# EAGLE design BH67172NUX-FPC (EAGLE 7.1.0)
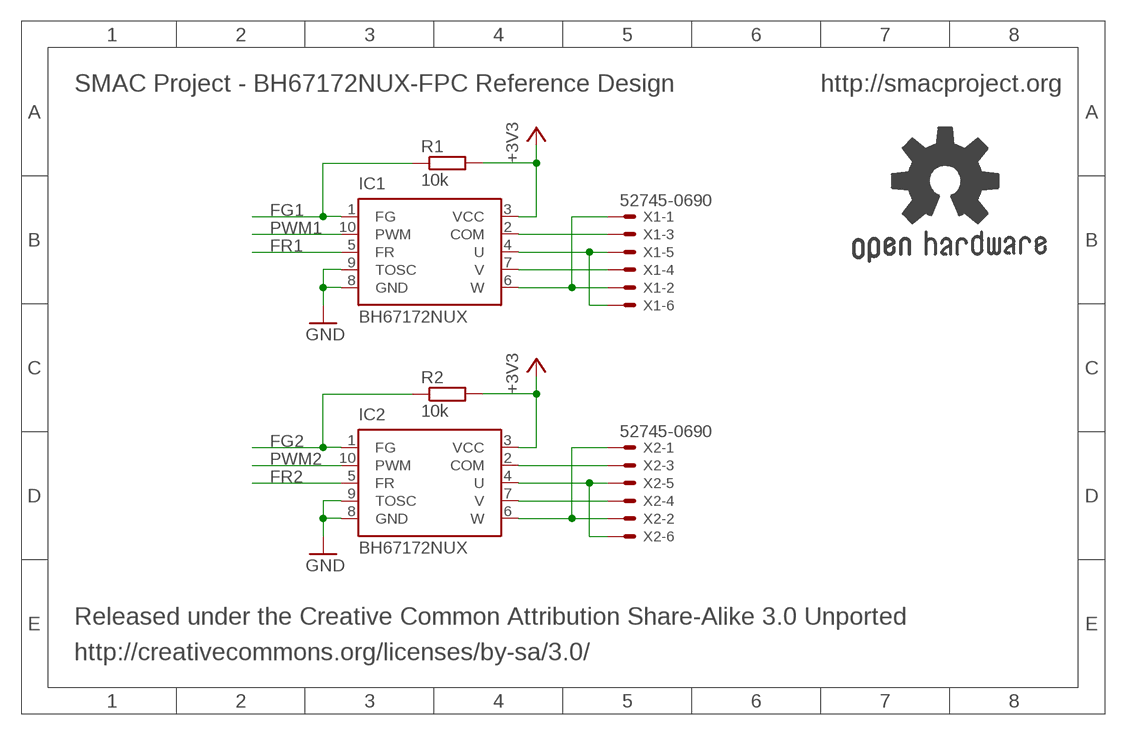
[diagram p0: schematic, sheet 1]

## Parts
GOLD_ORB_SM1  OSHWLOGO_REF_SM  [OSHW2REF]
IC1  BH67172NUX  [VSON010X3030]
IC2  BH67172NUX  [VSON010X3030]
R1  10k  R-EU_R0402  [R0402]
R2  10k  R-EU_R0402  [R0402]
X1  52745-0690  [52745-0690]
X2  52745-0690  [52745-0690]

## Nets
+3V3: IC1.3(VCC) IC2.3(VCC) R1.2 R2.2
COM1: IC1.2(COM) X1.3
COM2: IC2.2(COM) X2.3
FG1: IC1.1(FG) R1.1
FG2: IC2.1(FG) R2.1
FR1: IC1.5(FR)
FR2: IC2.5(FR)
GND: IC1.8(GND) IC1.9(TOSC) IC2.8(GND) IC2.9(TOSC)
PWM1: IC1.10(PWM)
PWM2: IC2.10(PWM)
U1: IC1.4(U) X1.5 X1.6
U2: IC2.4(U) X2.5 X2.6
V1: IC1.7(V) X1.4
V2: IC2.7(V) X2.4
W1: IC1.6(W) X1.1 X1.2
W2: IC2.6(W) X2.1 X2.2

## Notes on the sheet
- SMAC Project - BH67172NUX-FPC Reference Design | http://smacproject.org
- Released under the Creative Common Attribution Share-Alike 3.0 Unported
- http://creativecommons.org/licenses/by-sa/3.0/

## Library data of the parts
GOLD_ORB_SM1 = bfl:OSHWLOGO: These are Open-Source Hardware logos.
IC1 IC2 = rohm:BH67172NUX
R1 R2 = resistor:R-EU_: RESISTOR, European symbol
X1 X2 = con-molex:52745-0690: FFC/FPC-to-Board 0.50mm (.020") SMT Top Contact Right Angle, ZIF, Style Receptacle 52745 / 52435 Source: http://www.molex.com/product/ffc/52745.html; MPN: 52745-0690; OC_FARNELL: unknown; OC_NEWARK: 92M6374

## Board
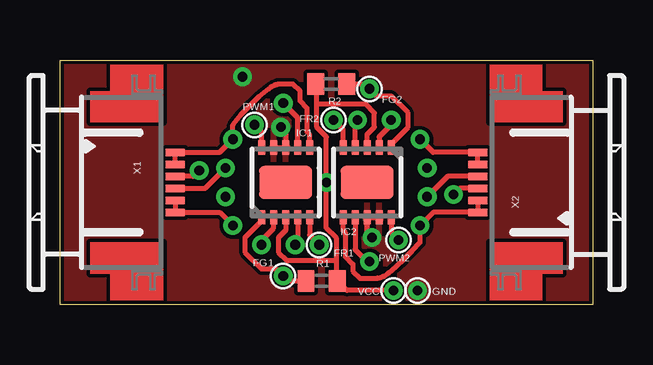
[diagram p1: board, top side]
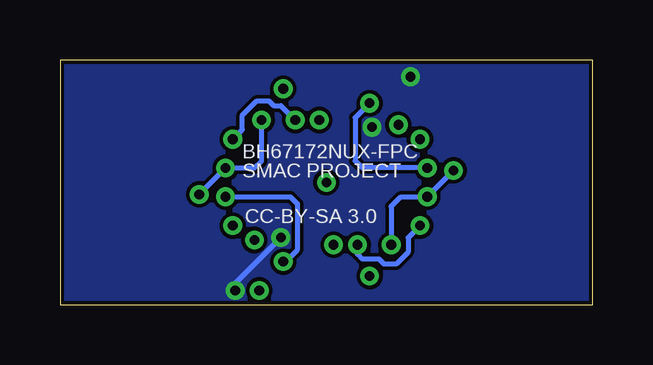
[diagram p2: board, bottom side, seen from below]

Size 22.2 x 10.2 mm. Coordinates in mm from the lower left corner, seen from the top.
Outline: 0,10.2 22.2,10.2 22.2,0 0,0 0,10.2
Copper layers (1*16): Top 0.035mm / dielectric 1.5mm / Bottom 0.035mm
Design rules "2_layer_standard_4pcb": minimum track width 5mil, minimum drill 15mil, track to track 6mil, track to pad 6mil, pad to pad 6mil, via to via 6mil, smd to smd 0mil, copper to edge 6mil, drill to drill 6mil, minimum pad ring 7.5mil, minimum via ring 7.5mil, stop-mask expansion 4mil, vias tented up to drill 15mil, thermal gap 20mil

### Footprints (pad centres in the part's own frame; a part is rotated, then mirrored left to right if it is on the bottom)
VSON010X3030 = smd 0.6 x 0.3: 1 -1.45,1; 2 -1.45,0.5; 3 -1.45,0; 4 -1.45,-0.5; 5 -1.45,-1; 6 1.45,-1; 7 1.45,-0.5; 8 1.45,0; 9 1.45,0.5; 10 1.45,1 | smd 1.36 x 2.2: G 0,0
R0402 = smd 0.7 x 0.9: 1 -0.65,0; 2 0.65,0
52745-0690 = smd 0.3 x 0.8: 1 -1.25,2.5; 2 -0.75,2.5; 3 -0.25,2.5; 4 0.25,2.5; 5 0.75,2.5; 6 1.25,2.5

### Placement (x,y rotation side)
GOLD_ORB_SM1  25.9,1.8 0 top  (outside the outline)
IC1  9.4,5.1 90 top
IC2  12.8,5.1 270 top
R1  10.9,1 0 top
R2  11.3,9.2 180 top
X1  2.3,5.1 270 top
X2  19.9,5.1 90 top

### Tracks (layer width: path | path; a pad name or v marks a point on that pad's centre or on a via)
+3V3  (via drill 0.4 pad 0.25)
  Top 0.203: IC1.3 9.4,3.1 9.1,2.8 9.1,2.2 9.45,1.85 11.5,1.85 | 10.7,8.35 12.75,8.35 13.1,8 13.1,7.4 12.8,7.1 IC2.3 | 11.5,1.85 11.5,2.8 11.1,3.2 v11.1,5.1 11.1,7 10.7,7.4 10.7,8.35 | 11.5,1.85 11.5,1.05 R1.2 11.95,0.6 v13.9,0.6 | 10.7,8.35 10.7,9.05 R2.2
COM1  (via drill 0.4 pad 0.25)
  Top 0.203: v8.4,2.5 8.4,2.7 8.9,3.2 IC1.2 | v5.8,5.6 5.55,5.35 X1.3
  Bottom 0.203: v8.4,2.5 8.4,4.1 8,4.5 v6.9,4.5 v5.8,5.6
COM2  (via drill 0.4 pad 0.25)
  Top 0.203: v13.8,7.7 13.8,7.5 13.3,7 IC2.2 | X2.3 16.65,4.85 v16.4,4.6
  Bottom 0.203: v13.8,7.7 13.8,6 14.1,5.7 v15.3,5.7 v16.4,4.6
FG1  (via drill 0.4 pad 0.25)
  Top 0.203: IC1.1 8.4,3.5 7.7,2.8 7.7,2.2 8.4,1.5 9,1.5 v9.3,1.2 9.5,1 R1.1
FG2  (via drill 0.4 pad 0.25)
  Top 0.203: IC2.1 13.8,6.7 14.5,7.4 14.5,8 13.8,8.7 13.2,8.7 v12.9,9 12.7,9.2 R2.1
FR1  (via drill 0.4 pad 0.25)
  Top 0.203: IC1.5 10.4,2.9 v10.8,2.5
FR2  (via drill 0.4 pad 0.25)
  Top 0.203: IC2.5 11.8,7.3 v11.4,7.7
GND  (via drill 0.4 pad 0.25)
  Top 0.203: IC1.9 IC1.8 9.4,7.2 v9.2,7.4 | v13,2.8 12.8,3 IC2.8
  Top 0.254: IC2.9 IC2.8
  Bottom 0.203: v13,2.8 14.9,0.9 v14.9,0.6
  other vias: 7.6,9.5
  pour Bottom: 0,10.2 22.2,10.2 22.2,0 0,0
  pour Top: 0,10.2 22.2,10.2 22.2,0 0,0
PWM1  (via drill 0.4 pad 0.25)
  Top 0.203: IC1.10 8.4,7.2 v8.1,7.5
PWM2  (via drill 0.4 pad 0.25)
  Top 0.203: IC2.10 13.8,3 v14.1,2.7
U1  (via drill 0.4 pad 0.25)
  Top 0.203: IC1.4 9.9,2.6 v9.8,2.5 | X1.5 X1.6 6.65,3.85 v7.2,3.3
  Bottom 0.203: v7.2,3.3 7.7,2.8 7.7,2.2 8.2,1.7 8.7,1.7 8.9,1.9 9.6,1.9 9.8,2.1 v9.8,2.5
U2  (via drill 0.4 pad 0.25)
  Top 0.203: IC2.4 12.3,7.6 v12.4,7.7 | X2.5 X2.6 15.55,6.35 v15,6.9
  Bottom 0.203: v15,6.9 14.6,7.3 14.6,7.9 14,8.5 13.5,8.5 13.3,8.3 13,8.3 v12.4,7.7
V1  (via drill 0.4 pad 0.25)
  Top 0.203: IC1.7 9.9,7.8 v9.3,8.4 | v6.9,5.7 6.05,4.85 X1.4
  Bottom 0.203: v6.9,5.7 9.6,5.7 9.9,6 9.9,7.8 v9.3,8.4
V2  (via drill 0.4 pad 0.25)
  Top 0.203: IC2.7 12.3,2.3 12.8,1.8 v12.9,1.8 | X2.4 16.15,5.35 v15.3,4.5
  Bottom 0.203: v15.3,4.5 12.6,4.5 12.3,4.2 12.3,2.3 12.8,1.8 v12.9,1.8
W1  (via drill 0.4 pad 0.25)
  Top 0.203: IC1.6 10.4,7.1 10.3,7.2 10.3,8.2 10,8.5 10,8.9 9.7,9.2 9.2,9.2 arc37 8.7,9 arc16 7.2,7.5 v7.2,6.9 6.65,6.35 X1.1 X1.2
W2  (via drill 0.4 pad 0.25)
  Top 0.203: IC2.6 11.8,3.1 11.9,3 11.9,2 12.2,1.7 12.2,1.4 12.5,1.1 13.1,1.1 arc28 13.5,1.2 arc9 14,1.6 arc7 15,2.6 v15,3.3 15.55,3.85 X2.1 X2.2

### Text on the board
tPlace: PWM1 | FG2 | FR2 | FR1 | PWM2 | FG1 | VCC | GND
bPlace: BH67172NUX-FPC | SMAC PROJECT | CC-BY-SA 3.0
Reference: http://smacproject.org